# EAGLE schematic thermistor_board (EAGLE 7.5.0)
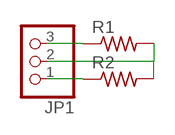
[diagram p0: schematic, sheet 1]

## Parts
JP1  PINHD-1X3  [1X03]
R1  RES-US1206  [R1206]
R2  RES-US1206  [R1206]

## Nets
GND: JP1.1 R2.1
N$1: JP1.3 R1.1
N$2: JP1.2 R1.2 R2.2

## Library data of the parts
JP1 = pinhead:PINHD-1X3: PIN HEADER
R1 R2 = fab:RES-US: Resistor (US Symbol) Variants with postfix FAB are widened to allow the routing of internal traces